# Altium schematic sheet nguyen_ly.SchDoc
size Letter; SheetNumber: 1; SheetTotal: 1
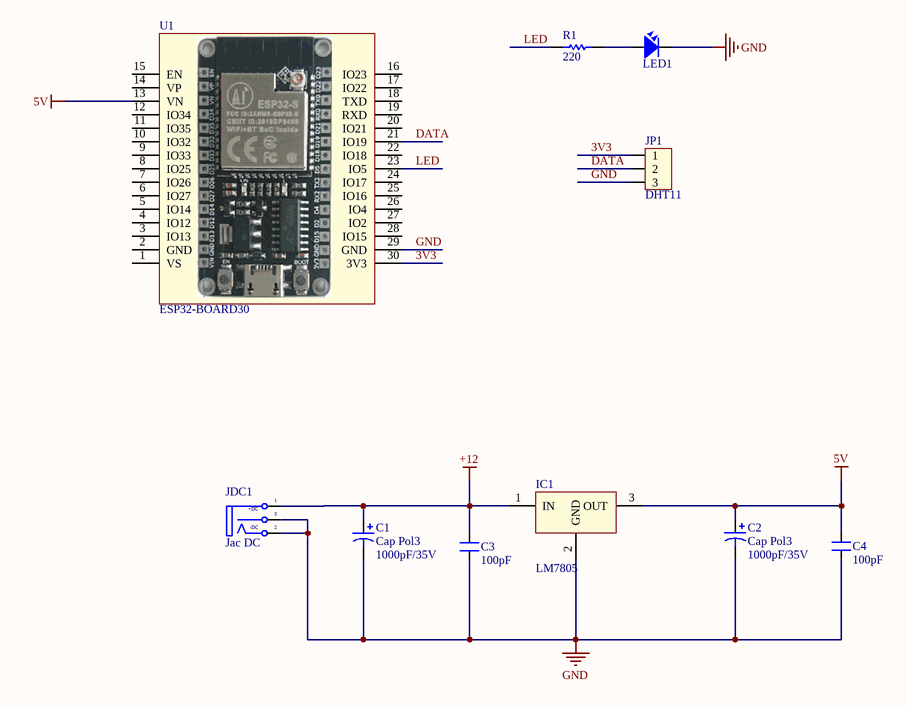
[diagram p0: nguyen_ly.SchDoc]

## Parts
C1  Cap Pol3  value 1000pF/35V  [CP2/5]
C2  Cap Pol3  value 1000pF/35V  [CP2/5]
C3  100pF  [CN1]
C4  100pF  [CN1]
IC1  LM7805  [QTO-220]
JDC1  Jac DC  [DC-IN]
JP1  DHT11  [CON3]
LED1  LED  [LED-3]  (value not drawn)
R1  value 220  [R1/4W]  (hidden comment: Res1)
U1  ESP32-BOARD30  [ESP32-BOARD30-900]

## Nets
5V: C2.1 C4.2 IC1.3(OUT) U1.13(VN)
+12: C1.1 C3.2 IC1.1(IN) JDC1.1(+DC)
GND: C1.2 C2.2 C3.1 C4.1 IC1.2(GND) JDC1.2(TN) JDC1.3(S) JP1.3 LED1.2 U1.29(GND)
3V3: JP1.1 U1.30(3V3)
DATA: JP1.2 U1.21(IO19)
LED: R1.2 U1.23(IO5)
NetLED1_1: LED1.1 R1.1

Not connected (* = marked no-connect by the designer): U1 1(VS) 2(GND) 3(IO13) 4(IO12) 5(IO14) 6(IO27) 7(IO26) 8(IO25) 9(IO33) 10(IO32) 11(IO35) 12(IO34) 14(VP) 15(EN) 16(IO23) 17(IO22) 18(TXD) 19(RXD) 20(IO21) 22(IO18) 24(IO17) 25(IO16) 26(IO4) 27(IO2) 28(IO15)

## Notes on the sheet
- (in symbol DCIN) -DC

## Library data of the parts
C1 C2 = Cap Pol3: Polarized Capacitor (Surface Mount); VALUE: C?; LatestRevisionDate: 17-Jul-2002; LatestRevisionNote: Re-released for DXP Platform.; PackageReference: C0805; Publisher: Altium Limited
C3 C4 = CN1: Cap np  1pF - 472pF; Value: 100pF
IC1 = LM78xx: On ap +, from + 5 to + 24VDC; Value: LM7805
JDC1 = DCIN: Jac DC input; Value: Jac DC
JP1 = Con3: Connector 3; Value: Connector 3
LED1 = LED: LED Single colour Green and Red; Value: LED 3 ly Single Colour
R1 = Res1_1: Resistor; Manufacturer: Generic Components; Class: Passive; Published: 08/06/2000; Publisher: Altium Hobart Technology Centre; SubClass: Resistor